# Altium schematic sheet [02] - BLOCK DIAGRAM.SchDoc
size A2; DocumentNumber: 2; SheetNumber: 2; SheetTotal: 18; PageSetup: Record=PageOptions|CenterHorizontal=True|CenterVertical=True|PrintScale=0.73|XCorrection=1.00|YCorrection=1.00|PrintKind=1|BorderSize=5000000|LeftOffset=0|BottomOffset=0|Orientation=2|PaperLength=1000|PaperWidth=1000|Scale=100|PaperSource=4|PrintQuality=300|MediaType=1|DitherType=10|PrintScaleMode=1|PaperKind=A4|PaperIndex=9
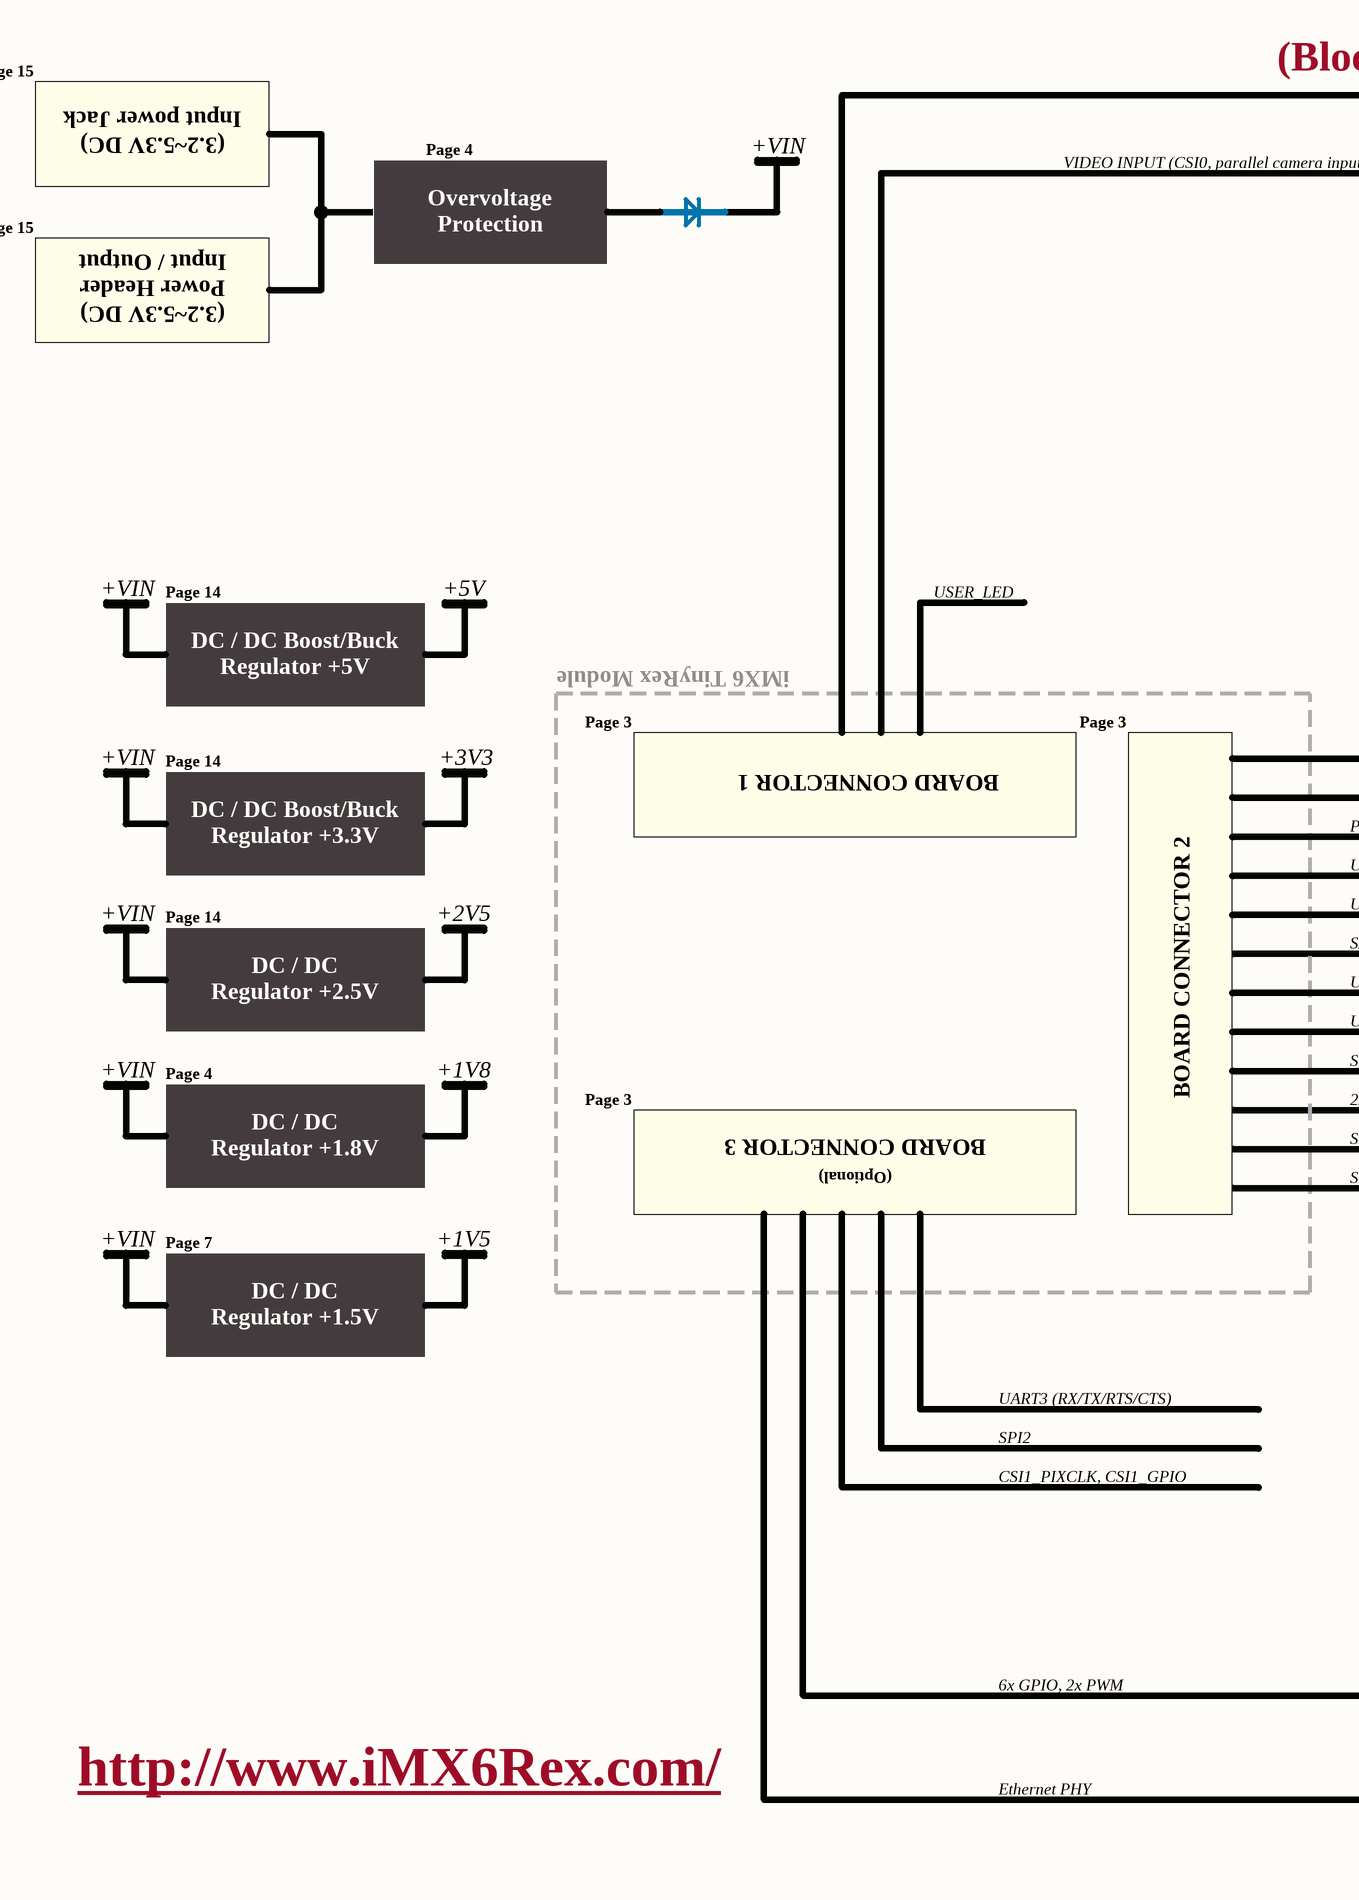
[diagram p0: [02] - BLOCK DIAGRAM.SchDoc, left]
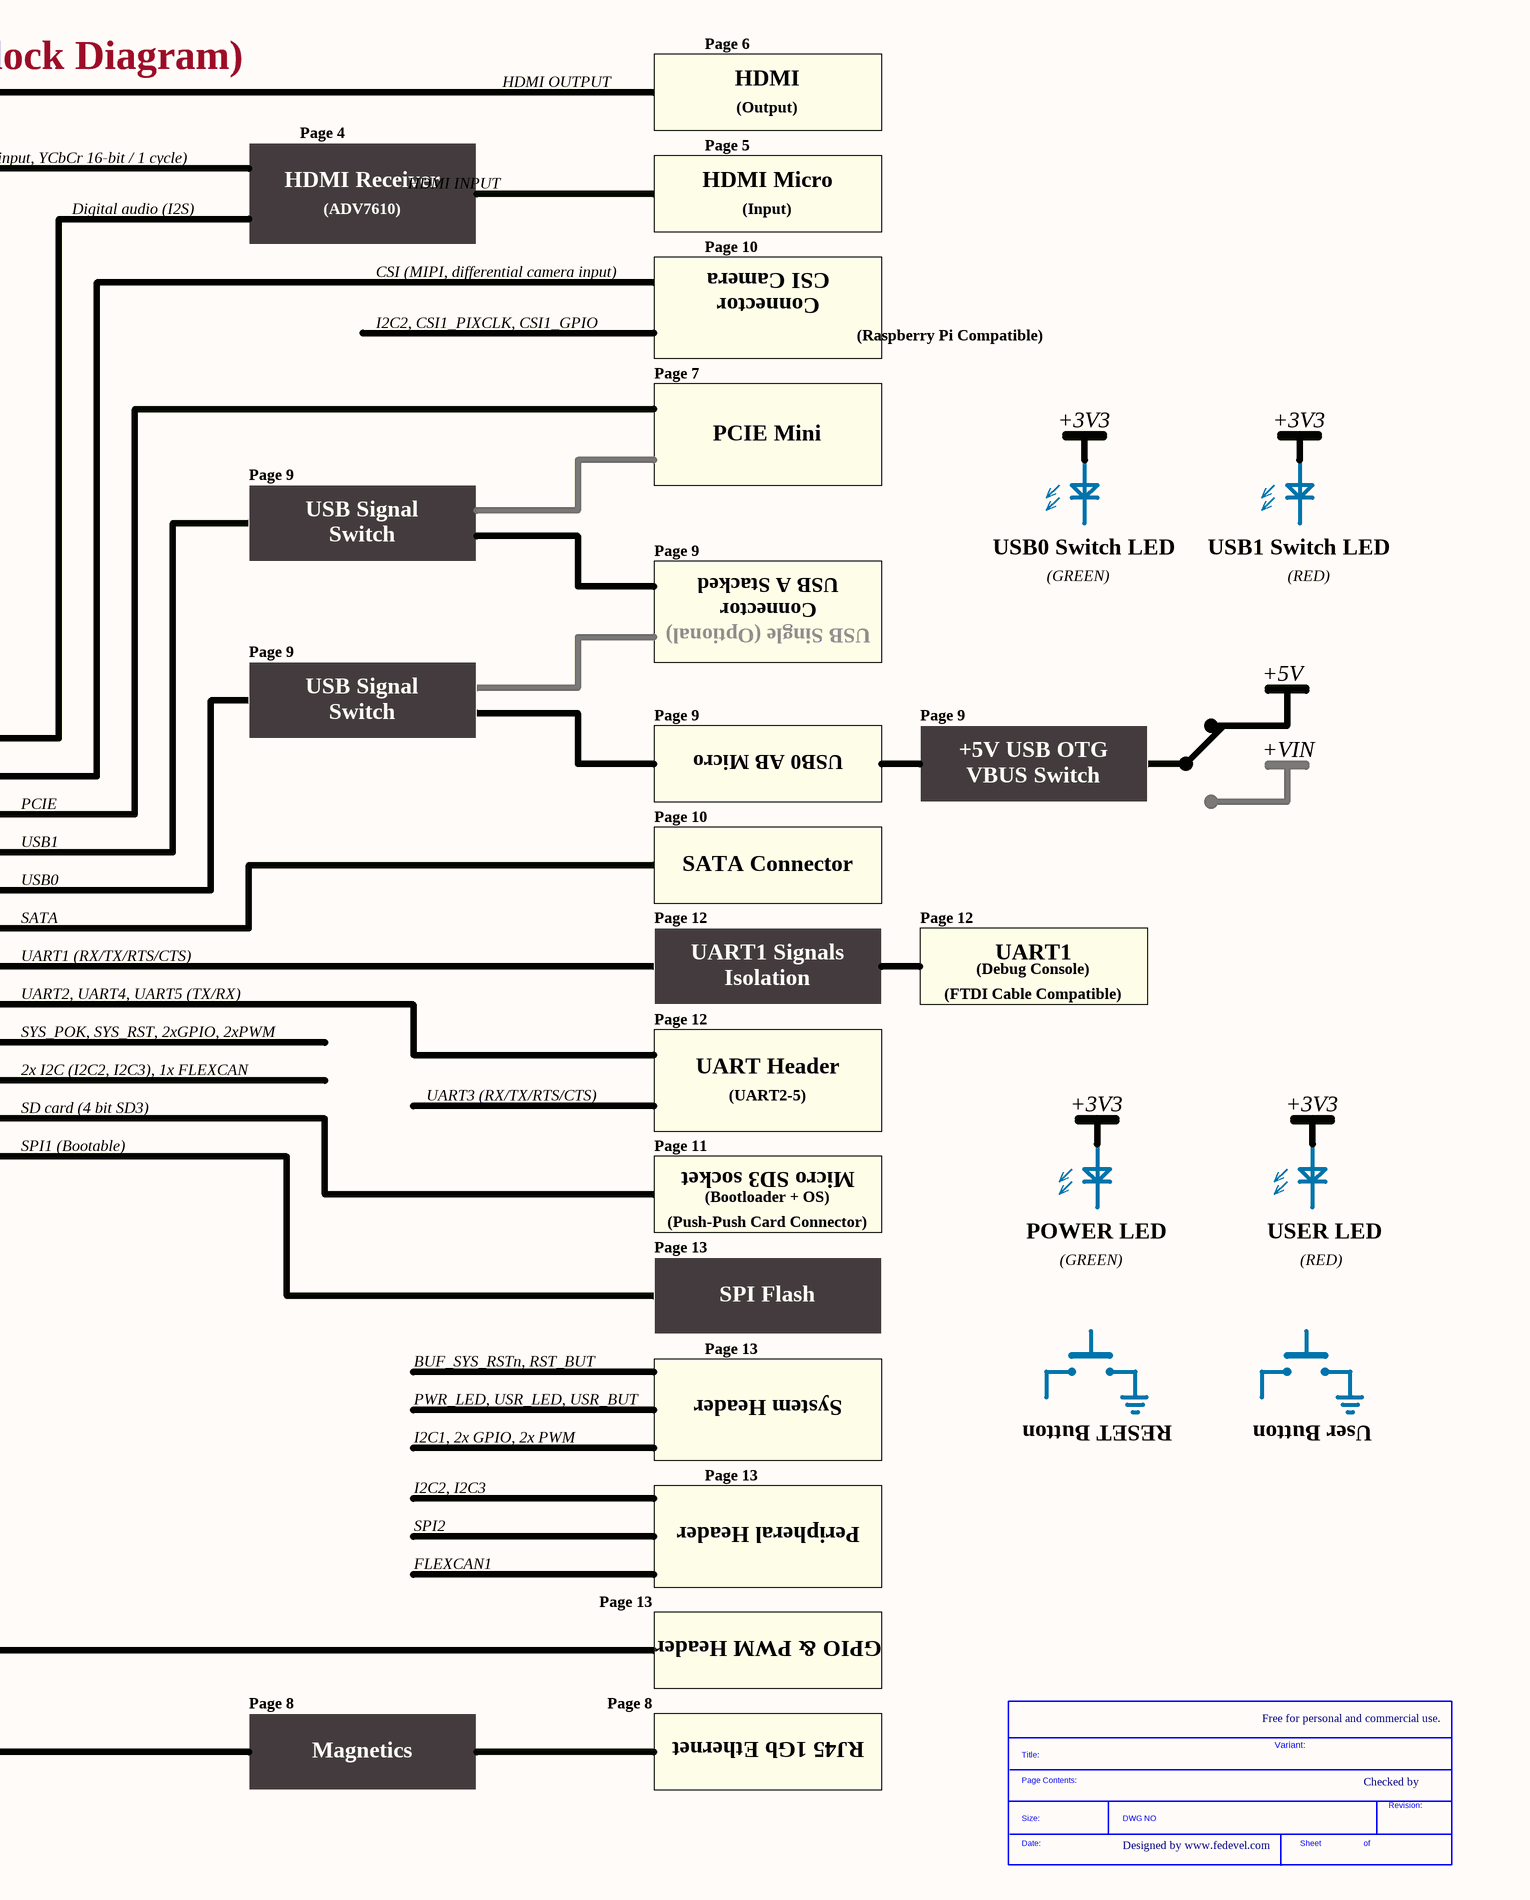
[diagram p1: [02] - BLOCK DIAGRAM.SchDoc, right]

## Parts
*  SDTitleBlock  (value not drawn)  (graphical)

## Notes on the sheet
- Page 15
- (Block Diagram)
- HDMI OUTPUT
- Page 6
- HDMI
- Input power Jack
- (3.2~5.3V DC)
- Page 4
- +VIN
- Page 5
- (Output)
- Overvoltage
- VIDEO INPUT (CSI0, parallel camera input, YCbCr 16-bit / 1 cycle)
- Digital audio (I2S)
- HDMI Receiver
- (ADV7610)
- HDMI INPUT
- HDMI Micro
- (Input)
- Input / Output
- Protection
- CSI (MIPI, differential camera input)
- Page 10
- Power Header
- I2C2, CSI1_PIXCLK, CSI1_GPIO
- CSI Camera
- Connector
- (Raspberry Pi Compatible)
- Page 7
- PCIE Mini
- +3V3
- Page 9
- USB Signal
- Page 14
- +5V
- USER_LED
- Switch
- USB A Stacked
- (GREEN)
- USB0 Switch LED
- (RED)
- USB1 Switch LED
- DC / DC Boost/Buck
- Regulator +5V
- USB Single (Optional)
- Page 3
- iMX6 TinyRex Module
- BOARD CONNECTOR 1
- USB0 AB Micro
- +5V USB OTG
- VBUS Switch
- Regulator +3.3V
- PCIE
- USB1
- +2V5
- USB0
- SATA Connector
- Regulator +2.5V
- DC / DC
- BOARD CONNECTOR 2
- SATA
- UART1 (RX/TX/RTS/CTS)
- Page 12
- UART1 Signals
- UART1
- (Debug Console)
- UART2, UART4, UART5 (TX/RX)
- SYS_POK, SYS_RST, 2xGPIO, 2xPWM
- Isolation
- (FTDI Cable Compatible)
- +1V8
- 2x I2C (I2C2, I2C3), 1x FLEXCAN
- UART3 (RX/TX/RTS/CTS)
- UART Header
- (UART2-5)
- Regulator +1.8V
- BOARD CONNECTOR 3
- (Optional)
- SD card (4 bit SD3)
- SPI1 (Bootable)
- Page 11
- +1V5
- Micro SD3 socket
- (Bootloader + OS)
- (Push-Push Card Connector)
- Regulator +1.5V
- Page 13
- POWER LED
- USER LED
- SPI Flash
- SPI2
- BUF_SYS_RSTn, RST_BUT
- PWR_LED, USR_LED, USR_BUT
- System Header
- CSI1_PIXCLK, CSI1_GPIO
- I2C1, 2x GPIO, 2x PWM
- RESET Button
- User Button
- I2C2, I2C3
- Peripheral Header
- FLEXCAN1
- 6x GPIO, 2x PWM
- GPIO & PWM Header
- Page 8
- Free for personal and commercial use.
- http://www.iMX6Rex.com/
- Ethernet PHY
- Magnetics
- RJ45 1Gb Ethernet
- Variant:
- Checked by
- Designed by www.fedevel.com
- (in symbol SDTitleBlock) Title:; Page Contents:; Revision:; Size:; DWG NO; Date:; Sheet; of